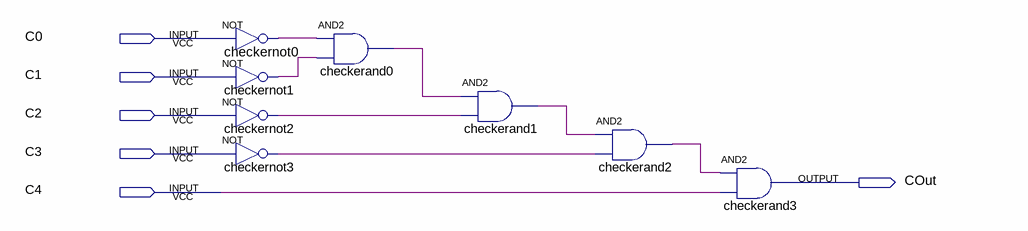
[diagram p0: schematic sheet]
// Quartus schematic ryu_checker.bdf as structural Verilog: 8 symbols, 6 pins
module ryu_checker (
  input  C0,
  input  C1,
  input  C2,
  input  C3,
  input  C4,
  output COut
);

  wire checkerand0_out, checkerand1_out, checkerand2_out, checkernot0_out, checkernot1_out, checkernot2_out,
       checkernot3_out;

  not checkernot0 (checkernot0_out, C0);
  not checkernot1 (checkernot1_out, C1);
  not checkernot2 (checkernot2_out, C2);
  not checkernot3 (checkernot3_out, C3);
  and checkerand0 (checkerand0_out, checkernot0_out, checkernot1_out);
  and checkerand1 (checkerand1_out, checkerand0_out, checkernot2_out);
  and checkerand2 (checkerand2_out, checkerand1_out, checkernot3_out);
  and checkerand3 (COut, checkerand2_out, C4);
endmodule
